# Altium project EEE3061WDesignProjectLineSensorBoard.PrjPcb
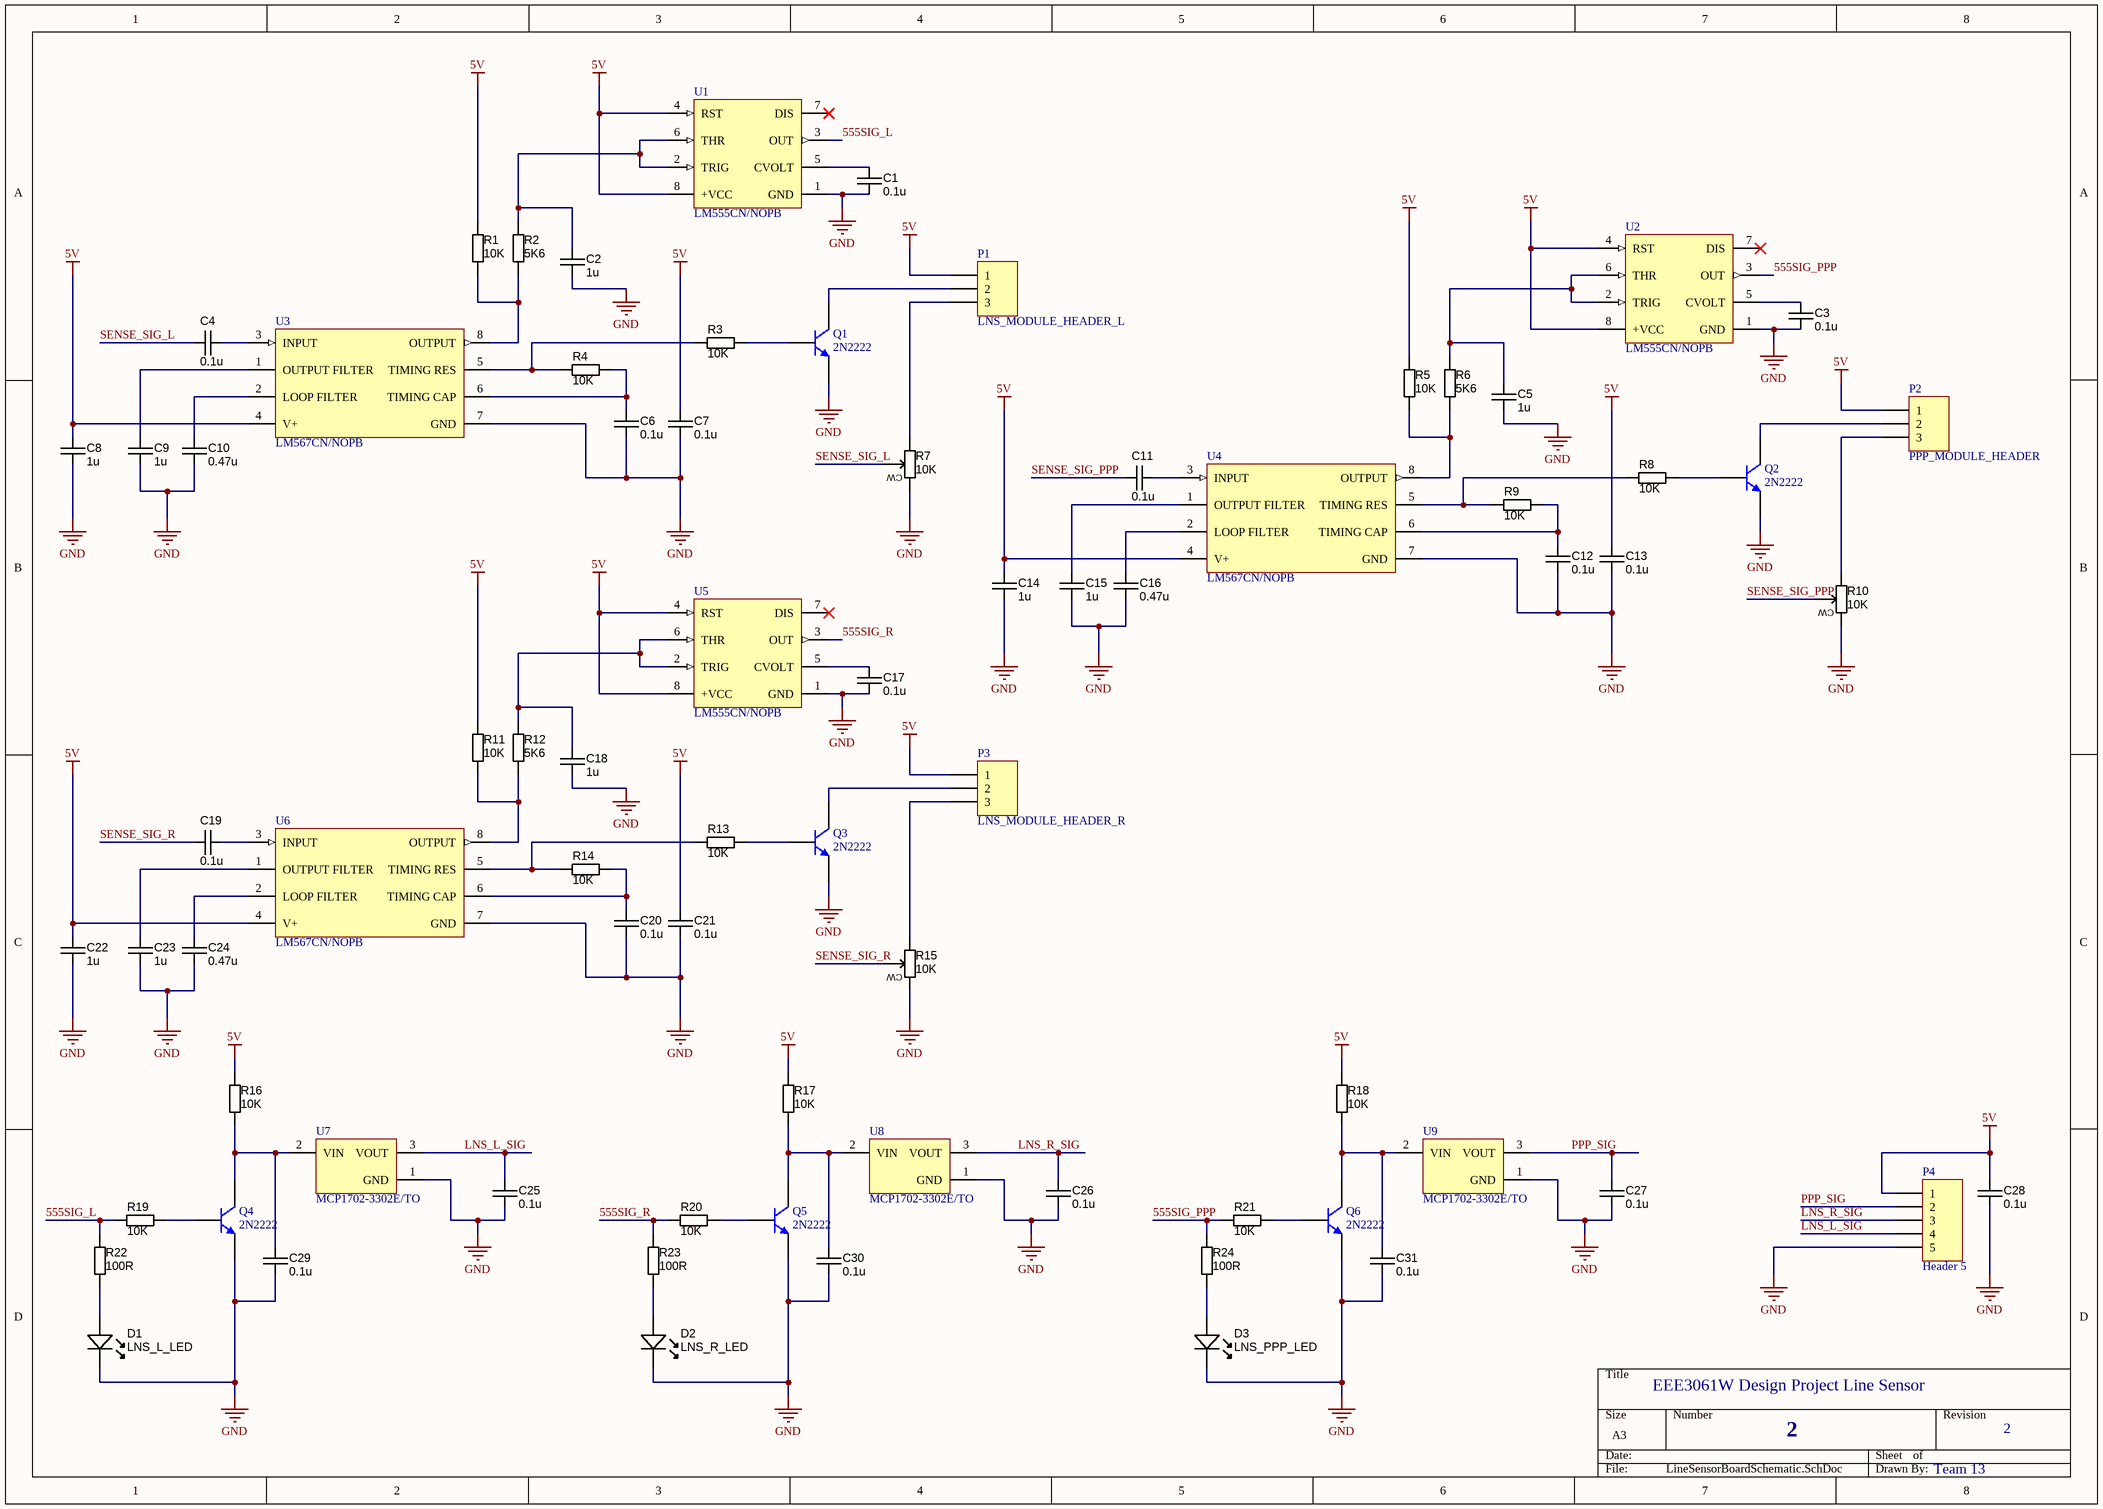
[diagram p0: LineSensorBoardSchematic.SchDoc]
1 sheet, 77 parts. Net scope: global (net labels, ports and power ports of the same name join across sheets).
Board file: LineSensorBoardPCBRev2.PcbDoc

## Sheet LineSensorBoardSchematic.SchDoc: EEE3061W Design Project Line Sensor
size A3; DrawnBy: Team 13; DocumentNumber: 2; Revision: 2

### Parts
C1  value 0.1u  [CAPC2012X135N]  (hidden comment: approved sub OK)
C2  value 1u  [CAPC2012X135N]  (hidden comment: approved sub OK)
C3  value 0.1u  [CAPC2012X135N]  (hidden comment: approved sub OK)
C4  value 0.1u  [CAPC2012X135N]  (hidden comment: approved sub OK)
C5  value 1u  [CAPC2012X135N]  (hidden comment: approved sub OK)
C6  value 0.1u  [CAPC2012X135N]  (hidden comment: approved sub OK)
C7  value 0.1u  [CAPC2012X135N]  (hidden comment: approved sub OK)
C8  value 1u  [CAPC2012X135N]  (hidden comment: approved sub OK)
C9  value 1u  [CAPC2012X135N]  (hidden comment: approved sub OK)
C10  value 0.47u  [CAPC2012X135N]  (hidden comment: approved sub OK)
C11  value 0.1u  [CAPC2012X135N]  (hidden comment: approved sub OK)
C12  value 0.1u  [CAPC2012X135N]  (hidden comment: approved sub OK)
C13  value 0.1u  [CAPC2012X135N]  (hidden comment: approved sub OK)
C14  value 1u  [CAPC2012X135N]  (hidden comment: approved sub OK)
C15  value 1u  [CAPC2012X135N]  (hidden comment: approved sub OK)
C16  value 0.47u  [CAPC2012X135N]  (hidden comment: approved sub OK)
C17  value 0.1u  [CAPC2012X135N]  (hidden comment: approved sub OK)
C18  value 1u  [CAPC2012X135N]  (hidden comment: approved sub OK)
C19  value 0.1u  [CAPC2012X135N]  (hidden comment: approved sub OK)
C20  value 0.1u  [CAPC2012X135N]  (hidden comment: approved sub OK)
C21  value 0.1u  [CAPC2012X135N]  (hidden comment: approved sub OK)
C22  value 1u  [CAPC2012X135N]  (hidden comment: approved sub OK)
C23  value 1u  [CAPC2012X135N]  (hidden comment: approved sub OK)
C24  value 0.47u  [CAPC2012X135N]  (hidden comment: approved sub OK)
C25  value 0.1u  [CAPC2012X135N]  (hidden comment: approved sub OK)
C26  value 0.1u  [CAPC2012X135N]  (hidden comment: approved sub OK)
C27  value 0.1u  [CAPC2012X135N]  (hidden comment: approved sub OK)
C28  value 0.1u  [CAPC2012X135N]  (hidden comment: approved sub OK)
C29  value 0.1u  [CAPC2012X135N]  (hidden comment: approved sub OK)
C30  value 0.1u  [CAPC2012X135N]  (hidden comment: approved sub OK)
C31  value 0.1u  [CAPC2012X135N]  (hidden comment: approved sub OK)
D1  Color: LNS_L_LED  [LED-0805-K]  (hidden comment: INDLED)
D2  Color: LNS_R_LED  [LED-0805-K]  (hidden comment: INDLED)
D3  Color: LNS_PPP_LED  [LED-0805-K]  (hidden comment: INDLED)
P1  LNS_MODULE_HEADER_L  [HDR1X3]
P2  PPP_MODULE_HEADER  [HDR1X3]
P3  LNS_MODULE_HEADER_R  [HDR1X3]
P4  Header 5  [HDR1X5]
Q1  2N2222  [TO-226-AA]
Q2  2N2222  [TO-226-AA]
Q3  2N2222  [TO-226-AA]
Q4  2N2222  [TO-226-AA]
Q5  2N2222  [TO-226-AA]
Q6  2N2222  [TO-226-AA]
R1  value 10K  [RESC2012X70N]  (hidden comment: Thick Film)
R2  value 5K6  [RESC2012X70N]  (hidden comment: Thick Film)
R3  value 10K  [RESC2012X70N]  (hidden comment: Thick Film)
R4  value 10K  [RESC2012X70N]  (hidden comment: Thick Film)
R5  value 10K  [RESC2012X70N]  (hidden comment: Thick Film)
R6  value 5K6  [RESC2012X70N]  (hidden comment: Thick Film)
R7  value 10K  [POT_3306F]  (hidden comment: Single-turn pot)
R8  value 10K  [RESC2012X70N]  (hidden comment: Thick Film)
R9  value 10K  [RESC2012X70N]  (hidden comment: Thick Film)
R10  value 10K  [POT_3306F]  (hidden comment: Single-turn pot)
R11  value 10K  [RESC2012X70N]  (hidden comment: Thick Film)
R12  value 5K6  [RESC2012X70N]  (hidden comment: Thick Film)
R13  value 10K  [RESC2012X70N]  (hidden comment: Thick Film)
R14  value 10K  [RESC2012X70N]  (hidden comment: Thick Film)
R15  value 10K  [POT_3306F]  (hidden comment: Single-turn pot)
R16  value 10K  [RESC2012X70N]  (hidden comment: Thick Film)
R17  value 10K  [RESC2012X70N]  (hidden comment: Thick Film)
R18  value 10K  [RESC2012X70N]  (hidden comment: Thick Film)
R19  value 10K  [RESC2012X70N]  (hidden comment: Thick Film)
R20  value 10K  [RESC2012X70N]  (hidden comment: Thick Film)
R21  value 10K  [RESC2012X70N]  (hidden comment: Thick Film)
R22  value 100R  [RESC2012X70N]  (hidden comment: Thick Film)
R23  value 100R  [RESC2012X70N]  (hidden comment: Thick Film)
R24  value 100R  [RESC2012X70N]  (hidden comment: Thick Film)
U1  LM555CN/NOPB  [N08E]
U2  LM555CN/NOPB  [N08E]
U3  LM567CN/NOPB  [N08E]
U4  LM567CN/NOPB  [N08E]
U5  LM555CN/NOPB  [N08E]
U6  LM567CN/NOPB  [N08E]
U7  MCP1702-3302E/TO  [TO-92-TO3]
U8  MCP1702-3302E/TO  [TO-92-TO3]
U9  MCP1702-3302E/TO  [TO-92-TO3]

### Nets
5V: C7.1 C8.1 C13.1 C14.1 C21.1 C22.1 C28.1 P1.1 P2.1 P3.1 P4.1 R1.1 R5.1 R11.1 R16.2 R17.2 R18.2 U1.4(RST) U1.8(+VCC) U2.4(RST) U2.8(+VCC) U3.4(V+) U4.4(V+) U5.4(RST) U5.8(+VCC) U6.4(V+)
GND: C1.2 C2.2 C3.2 C5.2 C6.2 C7.2 C8.2 C9.2 C10.2 C12.2 C13.2 C14.2 C15.2 C16.2 C17.2 C18.2 C20.2 C21.2 C22.2 C23.2 C24.2 C25.2 C26.2 C27.2 C28.2 C29.2 C30.2 C31.2 D1.K D2.K D3.K P4.5 Q1.3(E) Q2.3(E) Q3.3(E) Q4.3(E) Q5.3(E) Q6.3(E) R7.CW R10.CW R15.CW U1.1(GND) U2.1(GND) U3.7(GND) U4.7(GND) U5.1(GND) U6.7(GND) U7.1(GND) U8.1(GND) U9.1(GND)
555SIG_L: R19.1 R22.2 U1.3(OUT)
555SIG_PPP: R21.1 R24.2 U2.3(OUT)
555SIG_R: R20.1 R23.2 U5.3(OUT)
LNS_L_SIG: C25.1 P4.4 U7.3(VOUT)
LNS_R_SIG: C26.1 P4.3 U8.3(VOUT)
PPP_SIG: C27.1 P4.2 U9.3(VOUT)
SENSE_SIG_L: C4.2 R7.W
SENSE_SIG_PPP: C11.2 R10.W
SENSE_SIG_R: C19.2 R15.W
NetC1_1: C1.1 U1.5(CVOLT)
NetC2_1: C2.1 R2.1 U1.2(TRIG) U1.6(THR)
NetC3_1: C3.1 U2.5(CVOLT)
NetC4_1: C4.1 U3.3(INPUT)
NetC5_1: C5.1 R6.1 U2.2(TRIG) U2.6(THR)
NetC6_1: C6.1 R4.2 U3.6(TIMING_CAP)
NetC9_1: C9.1 U3.1(OUTPUT_FILTER)
NetC10_1: C10.1 U3.2(LOOP_FILTER)
NetC11_1: C11.1 U4.3(INPUT)
NetC12_1: C12.1 R9.2 U4.6(TIMING_CAP)
NetC15_1: C15.1 U4.1(OUTPUT_FILTER)
NetC16_1: C16.1 U4.2(LOOP_FILTER)
NetC17_1: C17.1 U5.5(CVOLT)
NetC18_1: C18.1 R12.1 U5.2(TRIG) U5.6(THR)
NetC19_1: C19.1 U6.3(INPUT)
NetC20_1: C20.1 R14.2 U6.6(TIMING_CAP)
NetC23_1: C23.1 U6.1(OUTPUT_FILTER)
NetC24_1: C24.1 U6.2(LOOP_FILTER)
NetC29_1: C29.1 Q4.1(C) R16.1 U7.2(VIN)
NetC30_1: C30.1 Q5.1(C) R17.1 U8.2(VIN)
NetC31_1: C31.1 Q6.1(C) R18.1 U9.2(VIN)
NetD1_A: D1.A R22.1
NetD2_A: D2.A R23.1
NetD3_A: D3.A R24.1
NetP1_2: P1.2 Q1.1(C)
NetP1_3: P1.3 R7.CCW
NetP2_2: P2.2 Q2.1(C)
NetP2_3: P2.3 R10.CCW
NetP3_2: P3.2 Q3.1(C)
NetP3_3: P3.3 R15.CCW
NetQ1_2: Q1.2(B) R3.2
NetQ2_2: Q2.2(B) R8.2
NetQ3_2: Q3.2(B) R13.2
NetQ4_2: Q4.2(B) R19.2
NetQ5_2: Q5.2(B) R20.2
NetQ6_2: Q6.2(B) R21.2
NetR1_2: R1.2 R2.2 U3.8(OUTPUT)
NetR3_1: R3.1 R4.1 U3.5(TIMING_RES)
NetR5_2: R5.2 R6.2 U4.8(OUTPUT)
NetR8_1: R8.1 R9.1 U4.5(TIMING_RES)
NetR11_2: R11.2 R12.2 U6.8(OUTPUT)
NetR13_1: R13.1 R14.1 U6.5(TIMING_RES)

Not connected (* = marked no-connect by the designer): U1 7(DIS)*; U2 7(DIS)*; U5 7(DIS)*

### Library data of the parts
C1-C31 = CAPC_1n8_50V_0805: Capacitor SMD Cer 1.8nF 10% 50V X7R 0805; Manufacturer 1: AVX Corporation; Manufacturer Part Number 1: 08055C182KAT2A; Ratings: 50V; X7R; SCDType: source*; Tolerance: ±10%; Operating Temperature: -55°C ~ 125°C; Package / Case: 0805 (2012 metric); Supplier 1: Digi-Key; Supplier Part Number 1: 478-1374-1-ND
D1 = LED_SMD_Green_0805_6mcd: LED, 0805 SMD, Green; Manufacturer 1: LITE-ON; Manufacturer Part Number 1: LTST-C171GKT; Material: GaP; Ratings: 6 mcd; 569 nm; Value: LNS_L_LED; SCDType: source; Package / Case: 0805; Supplier 1: Digi-Key; Supplier Part Number 1: 160-1423-1-ND
D2 = LED_SMD_Green_0805_6mcd: LED, 0805 SMD, Green; Manufacturer 1: LITE-ON; Manufacturer Part Number 1: LTST-C171GKT; Material: GaP; Ratings: 6 mcd; 569 nm; Value: LNS_R_LED; SCDType: source; Package / Case: 0805; Supplier 1: Digi-Key; Supplier Part Number 1: 160-1423-1-ND
D3 = LED_SMD_Green_0805_6mcd: LED, 0805 SMD, Green; Manufacturer 1: LITE-ON; Manufacturer Part Number 1: LTST-C171GKT; Material: GaP; Ratings: 6 mcd; 569 nm; Value: LNS_PPP_LED; SCDType: source; Package / Case: 0805; Supplier 1: Digi-Key; Supplier Part Number 1: 160-1423-1-ND
P1-P3 = Header 3: Header, 3-Pin; LatestRevisionDate: 17-Jul-2002; LatestRevisionNote: Re-released for DXP Platform.; Publisher: Altium Limited
P4 = Header 5: Header, 5-Pin; LatestRevisionDate: 17-Jul-2002; LatestRevisionNote: Re-released for DXP Platform.; Publisher: Altium Limited
Q1-Q6 = NPN: NPN Bipolar Transistor; Published: 8-Jun-2000; LatestRevisionDate: 17-Jul-2002; LatestRevisionNote: Re-released for DXP Platform.; PackageReference: TO-226-AA; Publisher: Altium Limited; PackageDescription: TO, Flat Index; 3 In-Line, Axial Leads; Body Dia. 4.8mm; Leads 0.55 x 0.51 mm (max); Code_JEDEC: TO-226-AA
R1-R6 R8 R9 R11-R14 R16-R24 = RES_150R_0805_5%: Resistor SMD chip 150 Ohm 0.125W 5% 0805; Manufacturer 1: Vishay/Dale; Manufacturer Part Number 1: CRCW0805150RJNEA; Ratings: 1/8W; SCDType: spec; Tolerance: ±5%; Package / Case: 0805 (2012 metric); Supplier 1: Digi-Key; Supplier Part Number 1: 541-150ACT-ND
R7 R10 R15 = RES_TRIMMER_10K_1T_THT: Trimmer THD 10K 200mW Single-turn; Manufacturer 1: Bourns Inc.; Manufacturer Part Number 1: 3306F-1-103; Tolerance: ±25%; Ratings: 1/5W; SCDType: spec; Supplier 1: Digi-Key; Supplier Part Number 1: 3306F-103-ND; Material: Cermet; Package / Case: 8.10mm L x 6.81mm W x 7.62mm H
U1 U2 U5 = CMP-0056-00016-2: Timer, 8-pin MDIP, Pb-Free; Manufacturer: National Semiconductor; CompType: Analog IC; PowerWise: N; PackageTopMarking: NSUZXYTTE#*LM*555CN; ComponentLink3Description: N08E Package Page; ComponentLink3URL: http://www.national.com/packaging/folders/n08e.html; ComponentLink1URL: http://www.national.com/ds/LM/LM555.pdf; PackageVersion: revG, May-2006; PackageDescription: MDIP, .365 x .250 x .130in, 8 Lead, .100in Pitch; ComponentLink1Description: LM555 Datasheet; RevisionNote: Component URLs added; ComponentLink2URL: http://www.national.com/pf/LM/LM555.html; RoHS: Y; Code_JEDEC: MS-001-BA; DatasheetVersion: Jul-2006; PackageReference: N08E; PinCount: 8; ComponentLink2Description: LM555 Web Page
U3 U4 U6 = CMP-0057-00046-2: Tone Decoder, 8-pin MDIP, Pb-Free; Manufacturer: National Semiconductor; CompType: Audio IC; PackageTopMarking: NSUZXYTTE#*LM*567CN; PowerWise: N; RevisionNote: Component URLs added; ComponentLink3URL: http://www.national.com/packaging/folders/n08e.html; ComponentLink1URL: http://www.national.com/ds/LM/LM567C.pdf; ComponentLink2URL: http://www.national.com/pf/LM/LM567C.html; ComponentLink2Description: LM567C Web Page; PackageDescription: MDIP, .365 x .250 x .130in, 8 Lead, .100in Pitch; PinCount: 8; Code_JEDEC: MS-001-BA; ComponentLink3Description: N08E Package Page; DatasheetVersion: Feb-2003; RoHS: Y; PackageReference: N08E; ComponentLink1Description: LM567C Datasheet; PackageVersion: revG, May-2006
U7-U9 = CMP-0136-00017-1: 250 mA Low Quiescent Current LDO Regulator, 3-Pin TO-92, Extended TemperatureBAG; PackageVersion: revBB, Aug-2009; DatasheetVersion: revD, Jun-2009; PackageDescription: 3-Lead Plastic Transistor Outline (TO) [TO-92]; PackageReference: TO-92-TO3